# Altium project line follower.PrjPcb
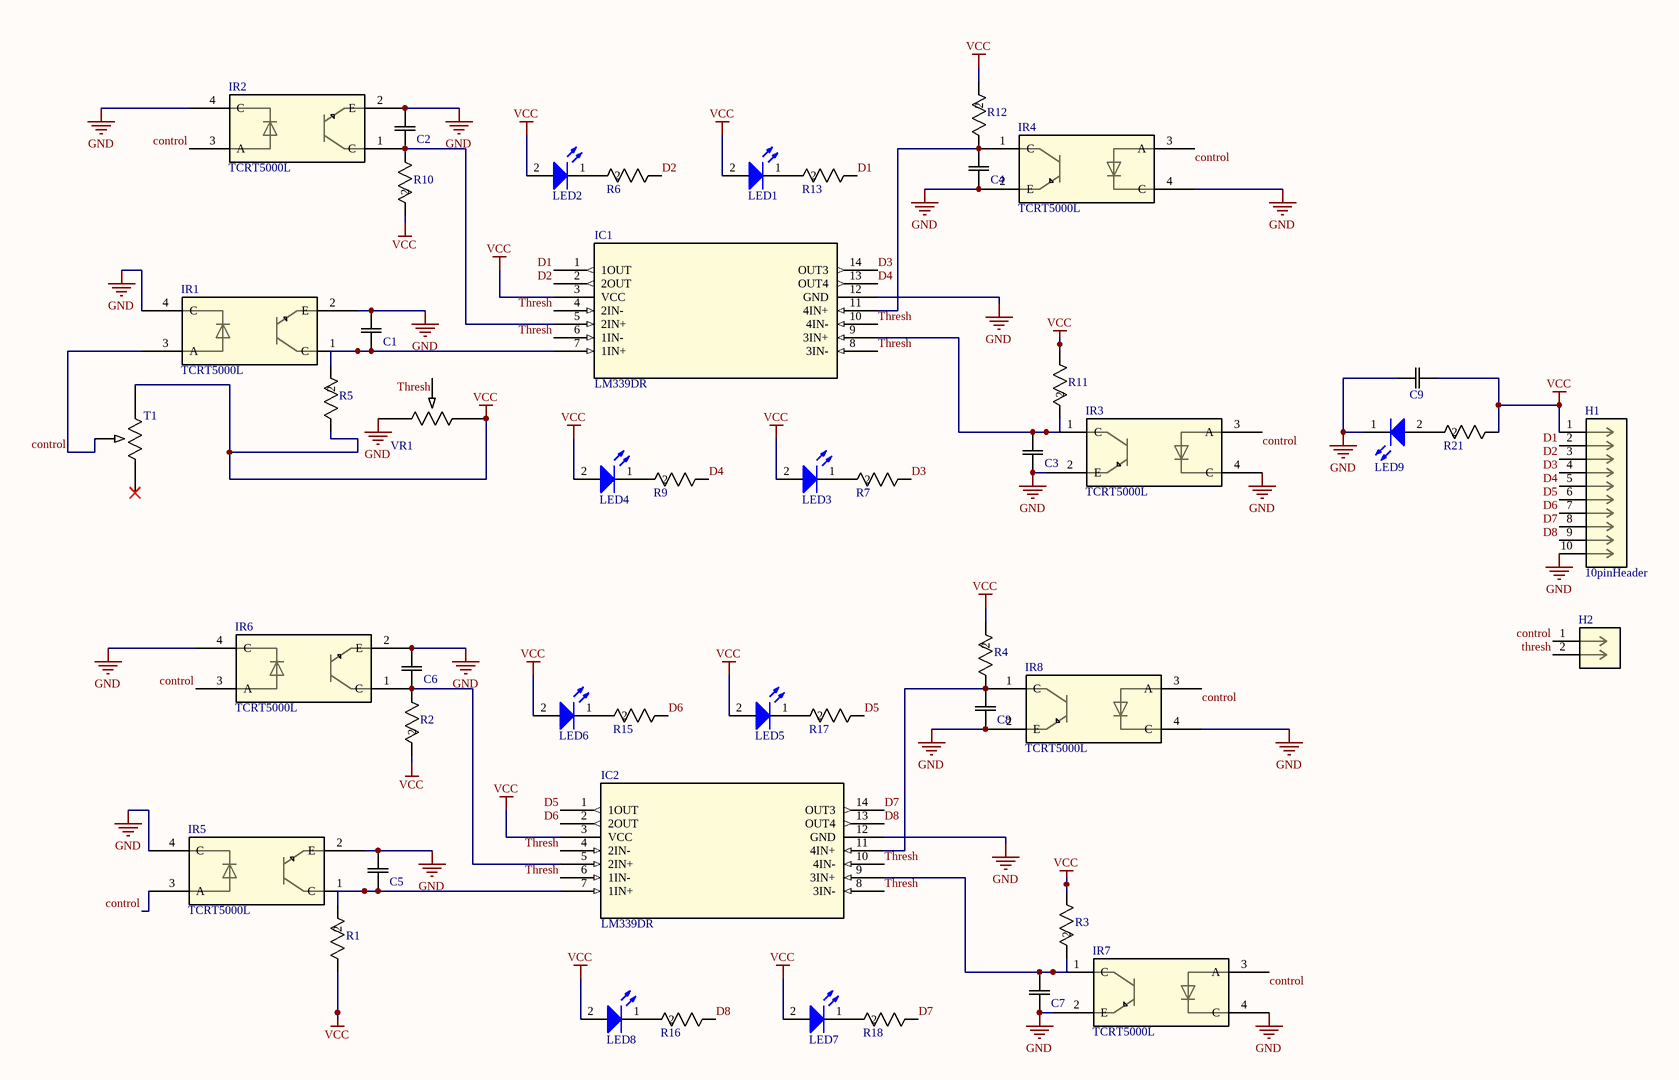
[diagram p0: LineFollowe.SchDoc]
1 sheet, 49 parts. Net scope: global (net labels, ports and power ports of the same name join across sheets).
Board file: LineFollower.PcbDoc

## Sheet LineFollowe.SchDoc
size A2; SheetNumber: 1; SheetTotal: 1

### Parts
C1  1206Capacitor  [CAP_1206_B_WAL]  (value not drawn)
C2  1206Capacitor  [CAP_1206_B_WAL]  (value not drawn)
C3  1206Capacitor  [CAP_1206_B_WAL]  (value not drawn)
C4  1206Capacitor  [CAP_1206_B_WAL]  (value not drawn)
C5  1206Capacitor  [CAP_1206_B_WAL]  (value not drawn)
C6  1206Capacitor  [CAP_1206_B_WAL]  (value not drawn)
C7  1206Capacitor  [CAP_1206_B_WAL]  (value not drawn)
C8  1206Capacitor  [CAP_1206_B_WAL]  (value not drawn)
C9  1206Capacitor  [CAP_1206_B_WAL]  (value not drawn)
H1  10pinHeader  [CONN_A-6373-10A_MOL]
H2  2pinJST  [CONN_B2B-XH-A_JST]  (value not drawn)
IC1  LM339DR  [D14]
IC2  LM339DR  [D14]
IR1  TCRT5000L  [TCRT5000_VIS]
IR2  TCRT5000L  [TCRT5000_VIS]
IR3  TCRT5000L  [TCRT5000_VIS]
IR4  TCRT5000L  [TCRT5000_VIS]
IR5  TCRT5000L  [TCRT5000_VIS]
IR6  TCRT5000L  [TCRT5000_VIS]
IR7  TCRT5000L  [TCRT5000_VIS]
IR8  TCRT5000L  [TCRT5000_VIS]
LED1  Blue, 3.2V, 70°  [WL-SMCW_1206_150120xx75000]  (value not drawn)
LED2  Blue, 3.2V, 70°  [WL-SMCW_1206_150120xx75000]  (value not drawn)
LED3  Blue, 3.2V, 70°  [WL-SMCW_1206_150120xx75000]  (value not drawn)
LED4  Blue, 3.2V, 70°  [WL-SMCW_1206_150120xx75000]  (value not drawn)
LED5  Blue, 3.2V, 70°  [WL-SMCW_1206_150120xx75000]  (value not drawn)
LED6  Blue, 3.2V, 70°  [WL-SMCW_1206_150120xx75000]  (value not drawn)
LED7  Blue, 3.2V, 70°  [WL-SMCW_1206_150120xx75000]  (value not drawn)
LED8  Blue, 3.2V, 70°  [WL-SMCW_1206_150120xx75000]  (value not drawn)
LED9  Blue, 3.2V, 70°  [WL-SMCW_1206_150120xx75000]  (value not drawn)
R1  1206Resistor  [RC1206N_YAG]  (value not drawn)
R2  1206Resistor  [RC1206N_YAG]  (value not drawn)
R3  1206Resistor  [RC1206N_YAG]  (value not drawn)
R4  1206Resistor  [RC1206N_YAG]  (value not drawn)
R5  1206Resistor  [RC1206N_YAG]  (value not drawn)
R6  1206Resistor  [RC1206N_YAG]  (value not drawn)
R7  1206Resistor  [RC1206N_YAG]  (value not drawn)
R9  1206Resistor  [RC1206N_YAG]  (value not drawn)
R10  1206Resistor  [RC1206N_YAG]  (value not drawn)
R11  1206Resistor  [RC1206N_YAG]  (value not drawn)
R12  1206Resistor  [RC1206N_YAG]  (value not drawn)
R13  1206Resistor  [RC1206N_YAG]  (value not drawn)
R15  1206Resistor  [RC1206N_YAG]  (value not drawn)
R16  1206Resistor  [RC1206N_YAG]  (value not drawn)
R17  1206Resistor  [RC1206N_YAG]  (value not drawn)
R18  1206Resistor  [RC1206N_YAG]  (value not drawn)
R21  1206Resistor  [RC1206N_YAG]  (value not drawn)
T1  Trimmer  [POT_3362P]  (value not drawn)
VR1  Trimmer  [POT_3362P]  (value not drawn)

### Nets
GND: C1.1 C2.2 C3.1 C4.2 C5.1 C6.2 C7.1 C8.2 C9.1 H1.10 IC1.12(GND) IC2.12(GND) IR1.2(E) IR1.4(C) IR2.2(E) IR2.4(C) IR3.2(E) IR3.4(C) IR4.2(E) IR4.4(C) IR5.2(E) IR5.4(C) IR6.2(E) IR6.4(C) IR7.2(E) IR7.4(C) IR8.2(E) IR8.4(C) LED9.1(K) VR1.1
VCC: C9.2 H1.1 IC1.3(VCC) IC2.3(VCC) LED1.2(A) LED2.2(A) LED3.2(A) LED4.2(A) LED5.2(A) LED6.2(A) LED7.2(A) LED8.2(A) R1.1 R2.2 R3.1 R4.2 R5.1 R10.2 R11.1 R12.2 R21.1 T1.3 VR1.3
control: H2.1 IR1.3(A) IR2.3(A) IR3.3(A) IR4.3(A) IR5.3(A) IR6.3(A) IR7.3(A) IR8.3(A) T1.2
D1: H1.2 IC1.1(1OUT) R13.1
D2: H1.3 IC1.2(2OUT) R6.1
D3: H1.4 IC1.14(OUT3) R7.1
D4: H1.5 IC1.13(OUT4) R9.1
D5: H1.6 IC2.1(1OUT) R17.1
D6: H1.7 IC2.2(2OUT) R15.1
D7: H1.8 IC2.14(OUT3) R18.1
D8: H1.9 IC2.13(OUT4) R16.1
Thresh: H2.2 IC1.4(2IN-) IC1.6(1IN-) IC1.8(3IN-) IC1.10(4IN-) IC2.4(2IN-) IC2.6(1IN-) IC2.8(3IN-) IC2.10(4IN-) VR1.2
NetC1_2: C1.2 IC1.7(1IN+) IR1.1(C) R5.2
NetC2_1: C2.1 IC1.5(2IN+) IR2.1(C) R10.1
NetC3_2: C3.2 IC1.9(3IN+) IR3.1(C) R11.2
NetC4_1: C4.1 IC1.11(4IN+) IR4.1(C) R12.1
NetC5_2: C5.2 IC2.7(1IN+) IR5.1(C) R1.2
NetC6_1: C6.1 IC2.5(2IN+) IR6.1(C) R2.1
NetC7_2: C7.2 IC2.9(3IN+) IR7.1(C) R3.2
NetC8_1: C8.1 IC2.11(4IN+) IR8.1(C) R4.1
NetLED1_1: LED1.1(K) R13.2
NetLED2_1: LED2.1(K) R6.2
NetLED3_1: LED3.1(K) R7.2
NetLED4_1: LED4.1(K) R9.2
NetLED5_1: LED5.1(K) R17.2
NetLED6_1: LED6.1(K) R15.2
NetLED7_1: LED7.1(K) R18.2
NetLED8_1: LED8.1(K) R16.2
NetLED9_2: LED9.2(A) R21.2

Not connected (* = marked no-connect by the designer): T1 1*

### Library data of the parts
C1 C3 C5 C7 = 1206Capacitor: 104; Mfr_Name: Walsin
C2 C4 C6 C8 C9 = 1206Capacitor: No Description Available; Mfr_Name: Walsin
H1 = 10pinHeader: No Description Available; Mfr_Name: Molex Connector Corporation; RefDes: RefDes; Type: Type
H2 = 2pinJST: No Description Available; Mfr_Name: JST; RefDes: RefDes; Type: Type
IC1 IC2 = LM339DR: No Description Available; Mfr_Name: Texas Instruments; RefDes: RefDes; Type: Type
IR1-IR8 = TCRT5000L: No Description Available; Mfr_Name: Vishay; RefDes: RefDes; Type: Type
LED1-LED9 = 1206Led: WL-SMCW Mono-color Chip LED Waterclear, SMT, size 1206, Blue, 3.2V, 70°; Manufacturer Part Number: 150120BS87000; Manufacturer: Wurth Elektronik; Case/Size Code: 1206; Chip Technology: InGaN; Dominant Wavelength: 470nm; Luminous Intensity: 300mcd; Peak Wavelength: 465nm; Category: Signal LEDs; Match Code: WL-SMCW; ComponentLink1Description: Website Link; ComponentLink1URL: https://www.we-online.com/redexpert/article/150120BS87000?ad; ComponentLink2Description: Datasheet Link; ComponentLink2URL: https://www.we-online.com/redexpert/spec/150120BS87000?ad; Mount: Surface Mount; Operating Temperature Max: 85°C; Operating Temperature Min: -40°C; Packaging: Tape and Reel; Length: 3.2mm; Width: 1.6mm; Height: 1.1mm; Emitting Color: Blue; Forward Voltage: 3.2V; Viewing Angle: 70°
R1 R3 R5 R11 = 1206Resistor: 10k; Mfr_Name: Yageo
R2 R4 R10 R12 = 1206Resistor: 10K; Mfr_Name: Yageo
R6 R7 R9 R13 R15-R18 = 1206Resistor: 1K; Mfr_Name: Yageo
R21 = 1206Resistor: No Description Available; Mfr_Name: Yageo
T1 = Trimmer: 1K; Mfr_Name: Bourns Electronics
VR1 = Trimmer: 10k; Mfr_Name: Bourns Electronics